# Altium schematic sheet Memory.SchDoc: MEMORY
size 431 x 279 mm; Date: 02/07/2022; ApprovedBy: RTZ,HYW; CheckedBy: RTZ,HYW; Author: RTZ,HYW; CompanyName: Upenn; DrawnBy: RTZ,HYW; Engineer: RTZ,HYW; Organization: Upenn ESE; Address1: Electrical Engineering; Address2: 200 South 33rd St; Address3: Philadelphia; Address4: PA, 19104; SheetNumber: 2; SheetTotal: 11; SCH_SCALE: NA; CAGE_CODE: TBD; DOC_NO_SCH_DWG: TBD; ENG_APP_DATE: 02/15/22; DSN_APP_DATE: 02/15/22; CHK_APP_DATE: 02/15/22; DOC_NO_ASSY_DWG: TBD; DOC_NO_FAB_DWG: TBD; PCB_DWG_NO: TBD; Project: SimonSayGame; DESIGN_ITEM: 1.0; Time: 13:18
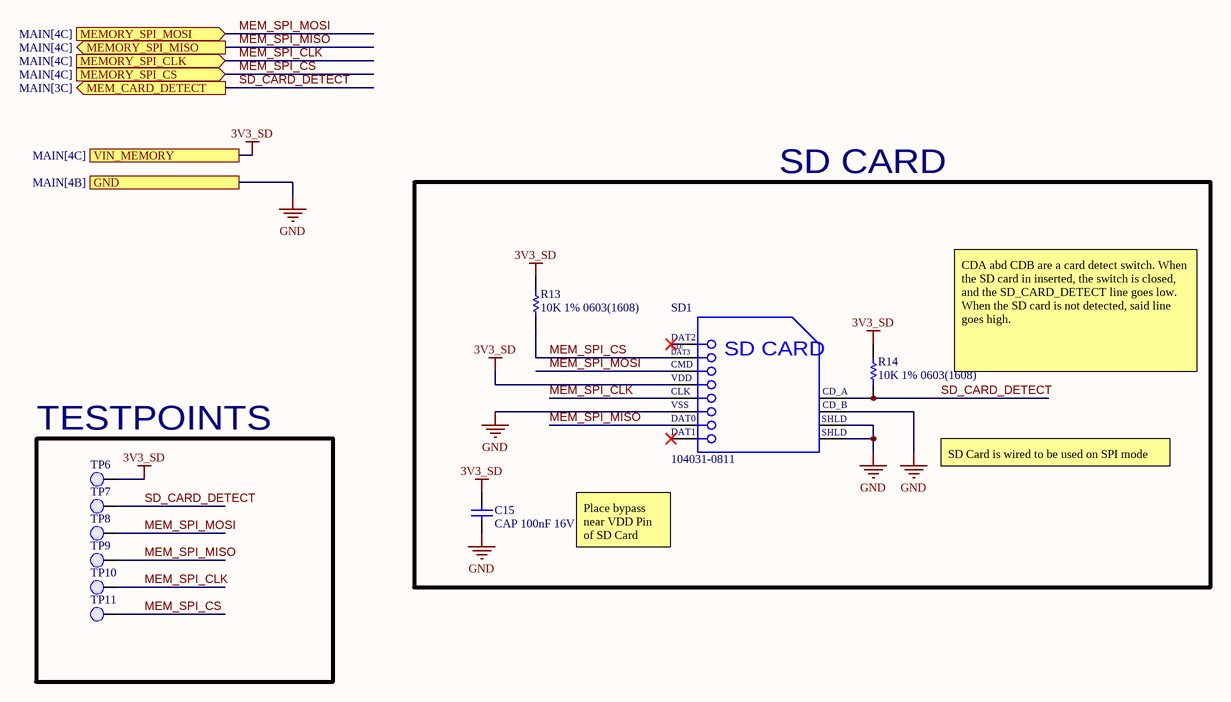
[diagram p0: Memory.SchDoc]

## Parts
C15  CAP 100nF 16V 0603(1608)  [CAPC0603(1608)100_N]
R13  10K 1% 0603(1608)  [RESC0603(1608)_N]
R14  10K 1% 0603(1608)  [RESC0603(1608)_N]
SD1  104031-0811  [MOLX-104031-0811_V]
TP6  0.1" Pad  [PCBComponent]  (value not drawn)  (no BOM)
TP7  0.1" Pad  [PCBComponent]  (value not drawn)  (no BOM)
TP8  0.1" Pad  [PCBComponent]  (value not drawn)  (no BOM)
TP9  0.1" Pad  [PCBComponent]  (value not drawn)  (no BOM)
TP10  0.1" Pad  [PCBComponent]  (value not drawn)  (no BOM)
TP11  0.1" Pad  [PCBComponent]  (value not drawn)  (no BOM)

## Blocks framed on the sheet
SD CARD: C15 R13 R14 SD1
TESTPOINTS: TP6-TP11

## Ports
GND (see MAIN[4B]), MEM_CARD_DETECT (out, see MAIN[3C]), MEMORY_SPI_CLK (in, see MAIN[4C]), MEMORY_SPI_CS (in, see MAIN[4C]), MEMORY_SPI_MISO (out, see MAIN[4C]), MEMORY_SPI_MOSI (in, see MAIN[4C]), VIN_MEMORY (see MAIN[4C])

## Nets
3V3_SD: C15.2 R13.2 R14.2 SD1.4(VDD) TP6.1(PAD) ; port VIN_MEMORY
GND: C15.1 SD1.6(VSS2) SD1.10(CD_B) SD1.11(SHLD1) SD1.12(SHLD2) ; port GND
MEM_SPI_CLK: SD1.5(CLK) TP10.1(PAD) ; port MEMORY_SPI_CLK
MEM_SPI_CS: R13.1 SD1.2(CMD) TP11.1(PAD) ; port MEMORY_SPI_CS
MEM_SPI_MISO: SD1.7(DAT0) TP9.1(PAD) ; port MEMORY_SPI_MISO
MEM_SPI_MOSI: SD1.3(VSS1) TP8.1(PAD) ; port MEMORY_SPI_MOSI
SD_CARD_DETECT: R14.1 SD1.9(CD_A) TP7.1(PAD) ; port MEM_CARD_DETECT

Not connected (* = marked no-connect by the designer): SD1 1(CD/DAT3)* 8(DAT1)*

## Notes on the sheet
- CDA abd CDB are a card detect switch. When the SD card in inserted, the switch is closed, and the SD_CARD_DETECT line goes low. When the SD card is not detected, said line goes high.
- SD Card is wired to be used on SPI mode
- Place bypass near VDD Pin of SD Card
- DWG. NO.
- REV.
- SHT.
- THIS DOCUMENT AND THE DATA DISCLOSED HEREIN OR HEREWITH IS THE PROPERTY OF ALTIUM LIMITED AND MAY BE FREELY DISTRIBUTED IN WHOLE. NO RIGHTS ARE RESERVED OR EXPRESS OR IMPLIED WARANTEE GIVEN.
- REVISION
- DESCRIPTION
- DATE
- APPROVED
- ENG:
- APPROVALS
- PROJECT
- DSN:
- CHK:
- REFERENCE DOCUMENTS
- PROJECT REVISION:
- TITLE
- DOCUMENT REVISION:
- DESIGN ITEM:
- BOM:
- FAB DWG:
- PCB DWG:
- ASSY DWG:
- SCALE:
- SIZE
- B
- CAGE CODE
- FILE NAME
- DWG NO.
- SHEET
- OF
- REV
- (in symbol CMP-2000-05825-1) DAT2; CD/; DAT3; SD CARD; VSS; SHLD

## Library data of the parts
C15 = CMP-1035-02584-1: CAP 100nF 16V ±10% 0603 (1608 Metric) Thickness 1mm SMD; Tolerance: Â±10%; Case-EIA: 0603; Case-Metric: 1608; Technology: SMT; Max Thickness: 1 mm; Value: 100nF; Rated Voltage: 16 V
R13 R14 = CMP-1012-00623-1: 10K 0.1W 1% 0603 (1608 Metric)  SMD; Value: 10000.00 Ohm; Case-EIA: 0603; Case-Metric: 1608; Power: 0.1 W; Tolerance: 1 %; Technology: SMT
SD1 = CMP-2000-05825-1: Micro SD Card, RA, -25 to 85 degC, 8-Pin SMD, RoHS, Tape and Reel; Voltage Rating: 10VAC/DC; Number of Contacts: 8; Insertion - Extraction Style: Push-Pull; Pitch: 1.1mm; Mating Cycles: 10000; Brand: Molex; Current Rating: 500mA; Manufacturer URL: http://www.molex.com/; Card Type: microSD; Mounting Type: Standard; Height: 1.42mm; Mounting Technology: SurfaceMount; Contact Plating: Gold; Product Category: MemoryCardConnectors; Package Description: 8-Pin Surface Mount Device, Body 11.95 x 11.4 mm, Pitch 1.1 mm; Datasheet URL: http://www.molex.com/pdm_docs/sd/1040310811_sd.pdf; Termination Style: SMD; Length: 11.4mm; Housing Material: LiquidCrystalPolymer(LCP); Orientation: RightAngle; RoHS: True; Contact Material: PhosphorBronze; Datasheet Version: Rev. E, 04/2006; Packaging: Reel; Manufacturer: Molex; Series: 104031; Product: CardConnectors; Number of Rows: 1Row; Package Reference: 104031-0811
TP6-TP11 = 0.1" Pad-A.4